# EasyEDA schematic EASYEDA_JSON.json

## Sheets
1 Mainboard_C3: TITLE: Verze Dva; REV: 1.0; Date: 2026-01-16; Sheet: 1/1; Drawn By: matyas.popela.07; Company: Cognitiv
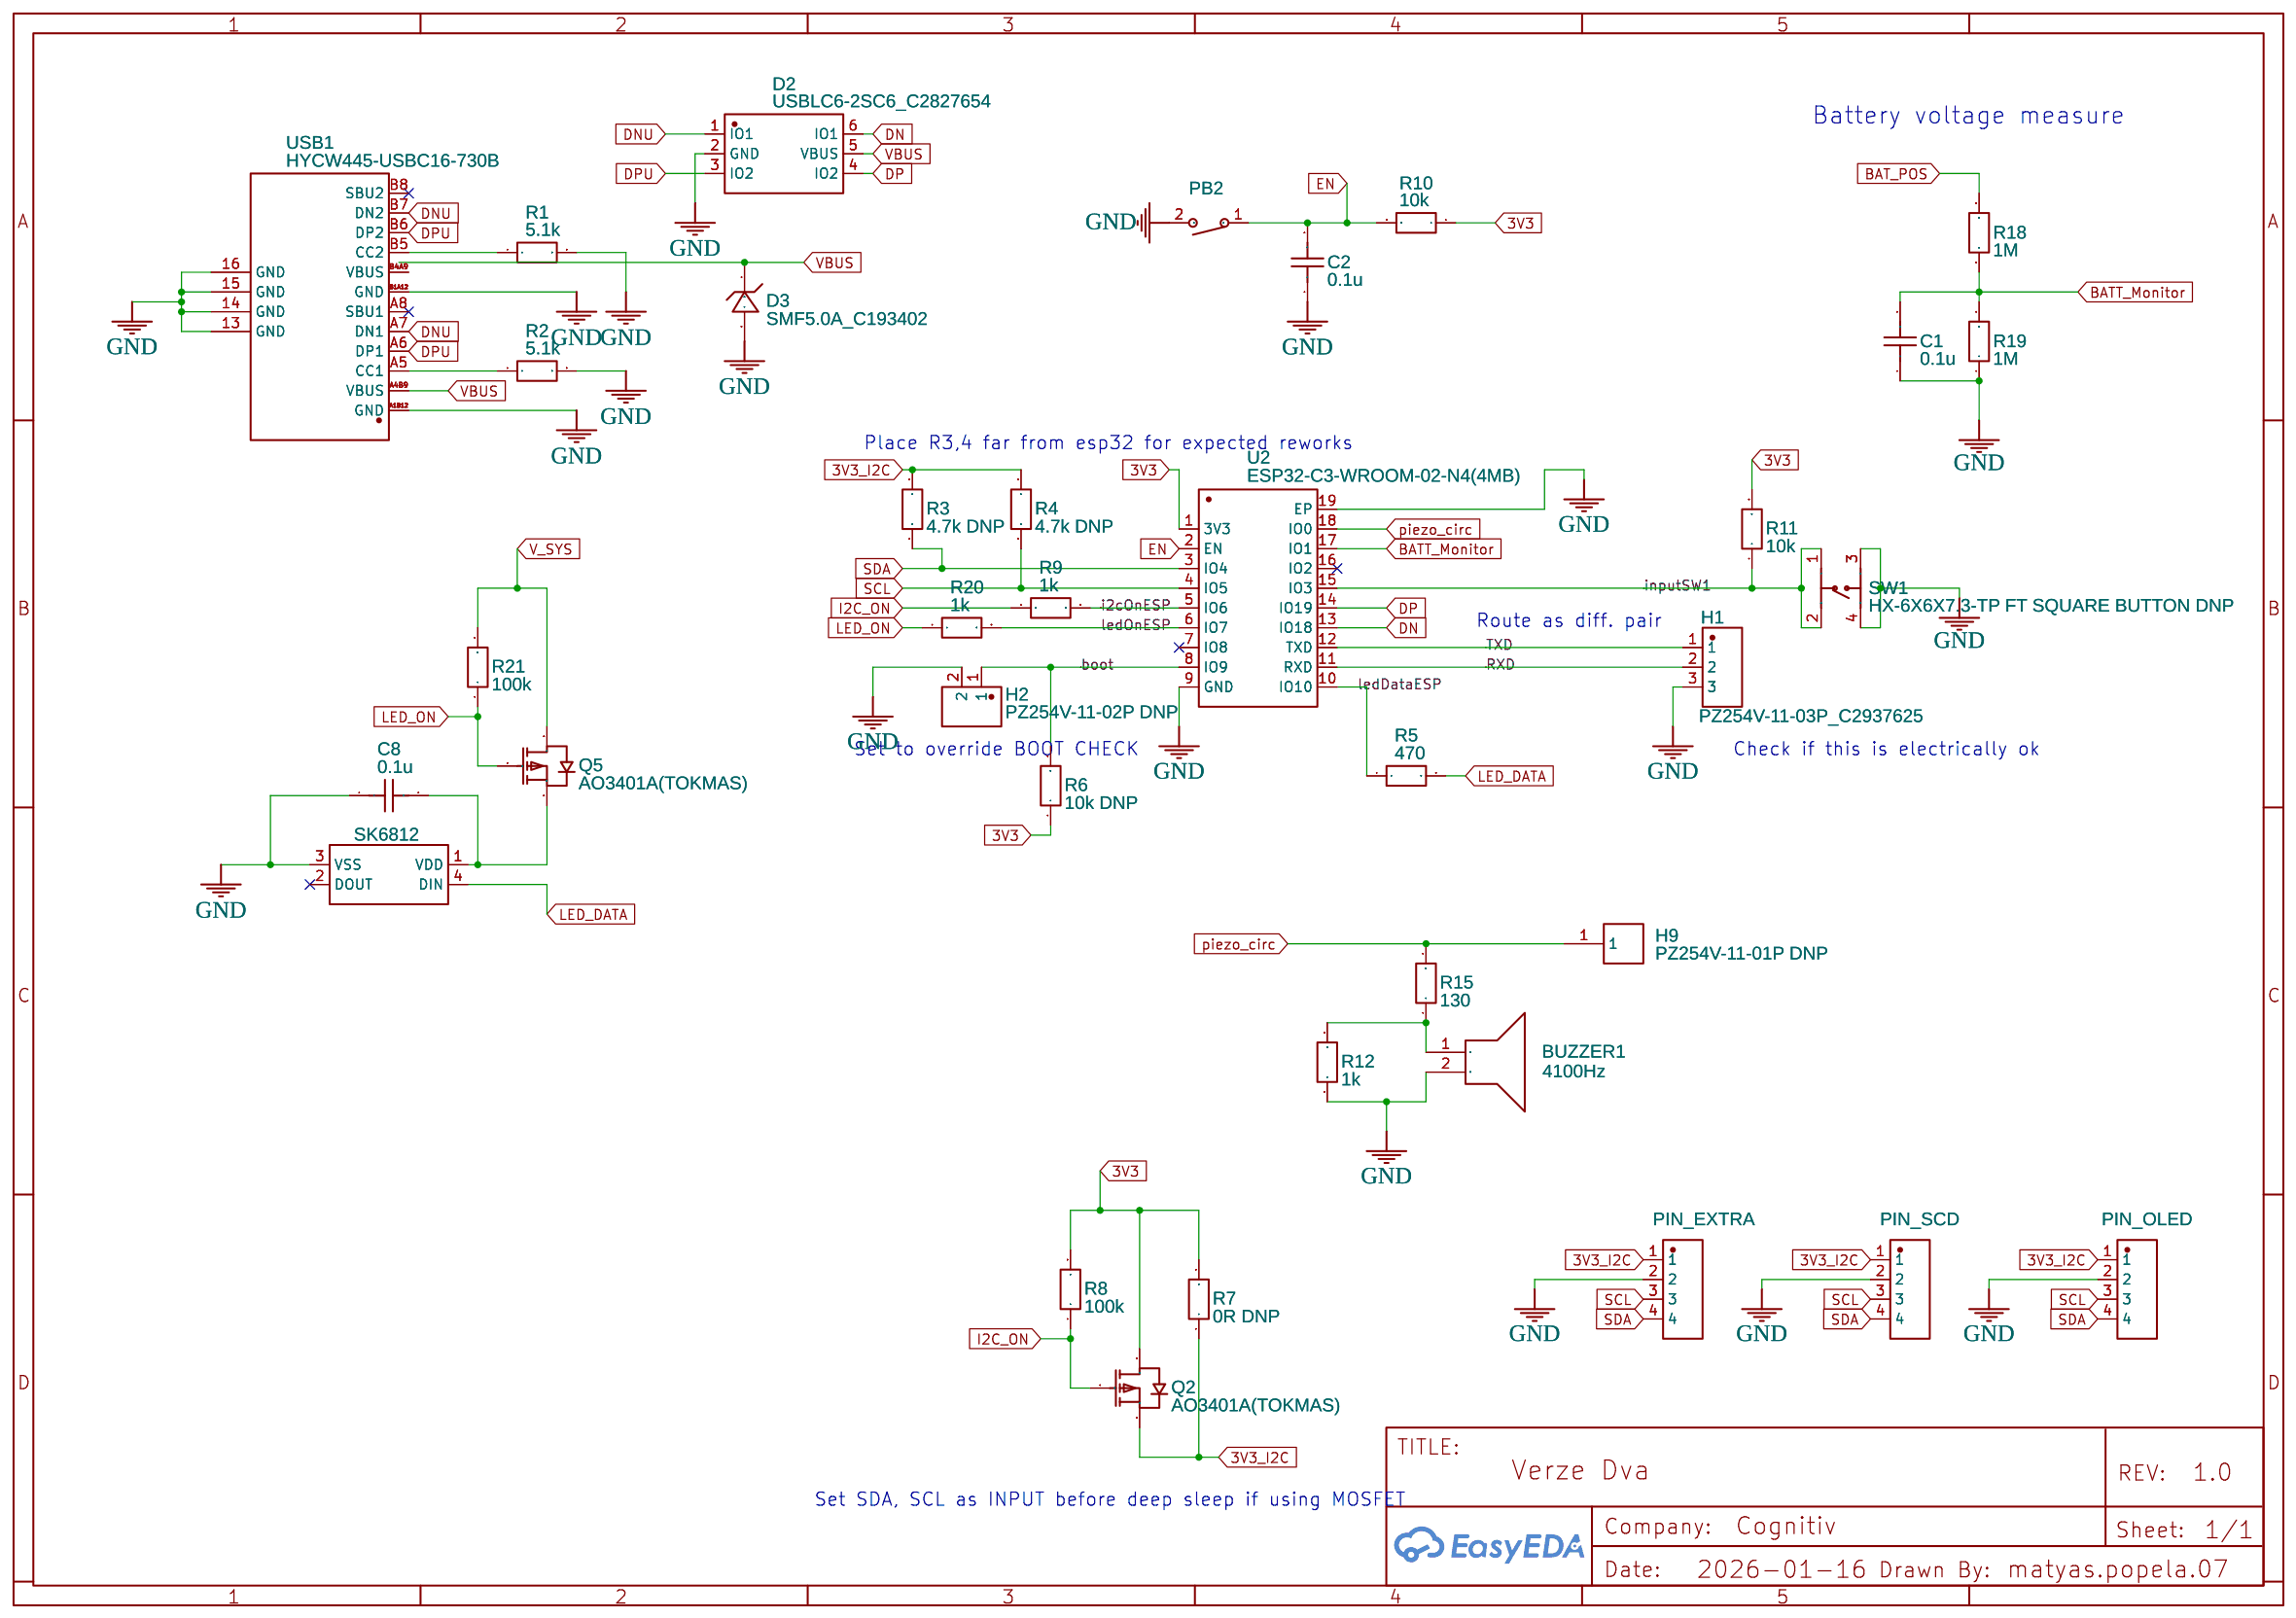
[diagram p0: Mainboard_C3]
2 Power_Management: TITLE: Power_sheet; Date: 2026-03-08; Drawn By: kzalesak; Company: Your Company
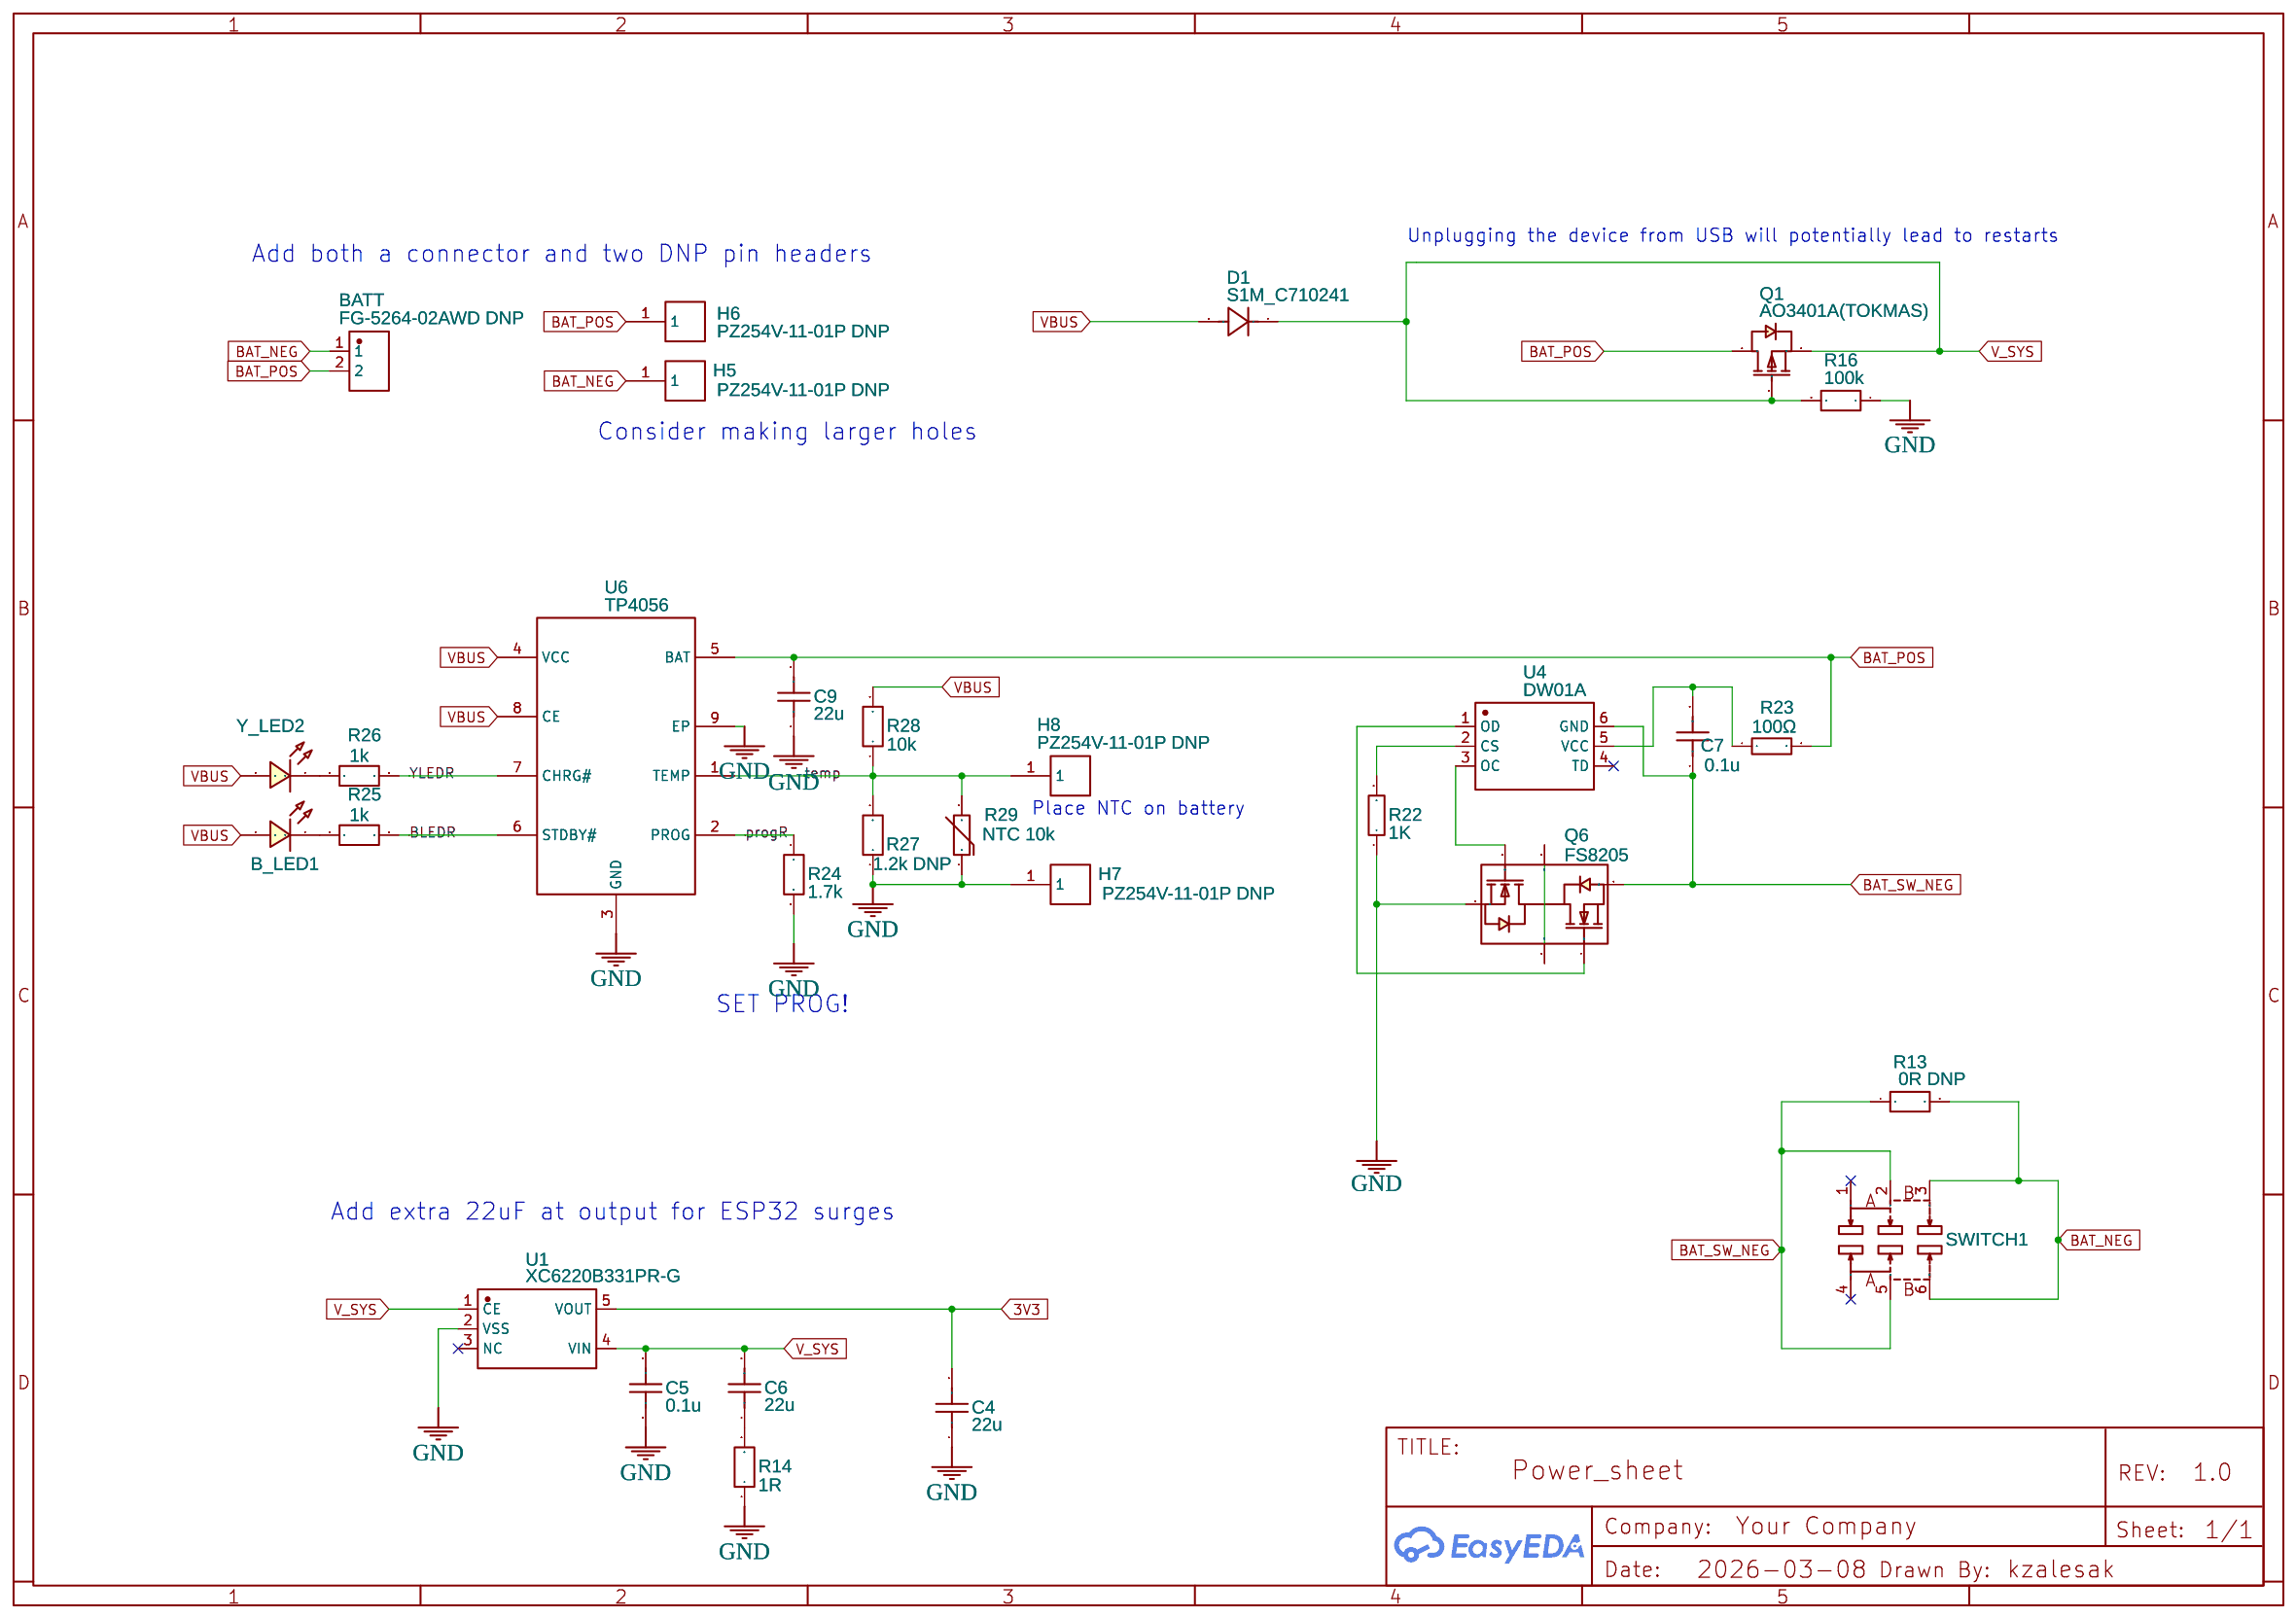
[diagram p1: Power_Management]

## Parts
sheet Mainboard_C3
BUZZER1  4100Hz  [BUZ-SMD_FST-1109]
C1  0.1u  [C0603]
C2  0.1u  [C0603]
C8  0.1u  [C0603]
D2  USBLC6-2SC6_C2827654  [SOT-23-6_L2.9-W1.6-P0.95-LS2.8-BL]
D3  SMF5.0A_C193402  [SOD-123FL_L2.7-W1.8-LS3.8-RD]
H1  PZ254V-11-03P_C2937625  [HDR-TH_3P-P2.54-V-M_PZ254V-11-03P]
H2  PZ254V-11-02P DNP  [HDR-TH_2P-P2.54-V-M]
H9  PZ254V-11-01P DNP  [HDR-TH_1P-P2.54-V-M]
PB2  HX 3X4X2-2P-1.6N TACTILE SWITCH DNP  [KEY-SMD_L4.0-W3.0-LS4.9-1]
PIN_EXTRA  2.54-1*4  [HDR-TH_4P-P2.54-V-M-1]
PIN_OLED  2.54-1*4  [HDR-TH_4P-P2.54-V-M-1]
PIN_SCD  2.54-1*4  [HDR-TH_4P-P2.54-V-M-1]
Q2  AO3401A(TOKMAS)  [SOT-23-3_L2.9-W1.3-P1.90-LS2.4-BR-1]
Q5  AO3401A(TOKMAS)  [SOT-23-3_L2.9-W1.3-P1.90-LS2.4-BR-1]
R1  5.1k  [R0603]
R2  5.1k  [R0603]
R3  4.7k DNP  [R0603]
R4  4.7k DNP  [R0603]
R5  470  [R0603]
R6  10k DNP  [R0603]
R7  0R DNP  [R0603]
R8  100k  [R0603]
R9  1k  [R0603]
R10  10k  [R0603]
R11  10k  [R0603]
R12  1k  [R0603]
R15  130  [R0603]
R18  1M  [R0603]
R19  1M  [R0603]
R20  1k  [R0603]
R21  100k  [R0603]
SK6812  SK6812_C5378720  [LED-SMD_4P-L5.0-W5.0-LS5.4-TL-1]
SW1  HX-6X6X7.3-TP FT SQUARE BUTTON DNP  [SW-SMD_4P-L6.0-W6.0-P4.50-LS9.0-H7.3]
U2  ESP32-C3-WROOM-02-N4(4MB)  [BULETM-SMD_ESPRESSIF_ESP32-C3-WROOM-02-N4-4MB]
USB1  HYCW445-USBC16-730B  [USB-TYPE-C-SMD_TYPE-C-16P-USB616FC]
sheet Power_Management
B_LED1  LED-0603_R  [LED0603_RED]
BATT  FG-5264-02AWD DNP  [CONN-TH_2P-P2.50_FG-5264-02AWD]
C4  22u  [C0805]
C5  0.1u  [C0603]
C6  22u  [C0805]
C7  0.1u  [C0603]
C9  22u  [C0805]
D1  S1M_C710241  [SMA_L4.3-W2.6-LS5.2-RD]
H5  PZ254V-11-01P DNP  [HDR-TH_1P-P2.54-V-M]
H6  PZ254V-11-01P DNP  [HDR-TH_1P-P2.54-V-M]
H7  PZ254V-11-01P DNP  [HDR-TH_1P-P2.54-V-M]
H8  PZ254V-11-01P DNP  [HDR-TH_1P-P2.54-V-M]
Q1  AO3401A(TOKMAS)  [SOT-23-3_L2.9-W1.3-P1.90-LS2.4-BR-1]
Q6  FS8205  [SOT-23-6]
R13  0R DNP  [R0805]
R14  1R  [R0603]
R16  100k  [R0603]
R22  1K  [0603]
R23  100Ω  [0603]
R24  1.7k  [R0805]
R25  1k  [R0603]
R26  1k  [R0603]
R27  1.2k DNP  [R0603]
R28  10k  [R0603]
R29  NTC 10k  [R0805]
SWITCH1  MST22D18G2 125 DNP  [SW-SMD_MST22D18G2]
U1  XC6220B331PR-G  [SOT-89-5_L4.5-W2.5-P1.50-LS4.4-BR]
U4  DW01A  [SOT-23-6L]
U6  TP4056  [ESOP-8_L4.9-W3.9-P1.27-LS6.0-BL-EP]
Y_LED2  LED-0603_R  [LED0603_RED]

## Library data of the parts
BUZZER1 = FST-1109: Contributor: LCSC; Supplier: LCSC; Supplier Part: C391036; Manufacturer: FUET(福声科技); Manufacturer Part: FUET-1109; JLCPCB Part Class: Extended Part
C1 C2 C5 C7 C8 = C_0603_US: Supplier Part: C14663; Supplier: LCSC; Contributor: LCEDA_Lib; Manufacturer Part: CC0603KRX7R9BB104; Manufacturer: YAGEO(国巨)
D2 = USBLC6-2SC6_C2827654: Contributor: LCSC; Supplier: LCSC; Supplier Part: C2827654; Manufacturer: TECH PUBLIC(台舟); Manufacturer Part: USBLC6-2SC6; JLCPCB Part Class: Extended Part
D3 = SMF5.0A_C193402: Contributor: LCSC; Supplier: LCSC; Supplier Part: C193402; Manufacturer: MDD(辰达半导体); Manufacturer Part: SMF5.0A; JLCPCB Part Class: Extended Part
H1 = PZ254V-11-03P_C2937625: Contributor: LCSC; Supplier: LCSC; Supplier Part: C2937625; Manufacturer: XFCN(兴飞); Manufacturer Part: PZ254V-11-03P; JLCPCB Part Class: Extended Part
H2 = PZ254V-11-02P: Contributor: LCSC; Supplier: LCSC; Supplier Part: C492401; Manufacturer: XFCN(兴飞); JLCPCB Part Class: Extended Part
H5-H9 = PZ254V-11-01P: Contributor: LCSC; Supplier: LCSC; Supplier Part: C492400; Manufacturer: XFCN(兴飞); JLCPCB Part Class: Extended Part
PB2 = HX 3X4X2-2P-1.6N TACTILE SWITCH: Supplier: LCSC; Supplier Part: C49234124; Manufacturer: hanxia(韩下); Manufacturer Part: HX 3x4x2-2P-1.6N TACTILE SWITCH; JLCPCB Part Class: Extended Part; Contributor: lcsc
PIN_EXTRA PIN_OLED PIN_SCD = 2.54-1*4: Supplier: LCSC; Supplier Part: C5116483; Manufacturer: ZHOURI(洲日); JLCPCB Part Class: Extended Part; Contributor: lcsc
Q1 Q2 Q5 = AO3401A(TOKMAS): Supplier: LCSC; Supplier Part: C51889389; Manufacturer: Tokmas(托克马斯); Contributor: lcsc; JLCPCB Part Class: Extended Part
R1-R16 R18-R21 R24-R28 = R_0603_EU: Contributor: LCEDA_Lib
SK6812 = SK6812_C5378720: Supplier: LCSC; Supplier Part: C5378720; Manufacturer: 欧思科光电; JLCPCB Part Class: Extended Part; Contributor: lcsc
SW1 = HX-6X6X7.3-TP FT SQUARE BUTTON: Supplier: LCSC; Supplier Part: C49234152; Manufacturer: hanxia(韩下); Manufacturer Part: HX-6x6x7.3-TP FT square button; JLCPCB Part Class: Extended Part; Contributor: lcsc
U2 = ESP32-C3-WROOM-02-N4(4MB): Contributor: LCSC; Supplier: LCSC; Supplier Part: C2934560; Manufacturer: ESPRESSIF(乐鑫); Manufacturer Part: ESP32-C3-WROOM-02-N4; JLCPCB Part Class: Extended Part
USB1 = HYCW445-USBC16-730B: Supplier: LCSC; Supplier Part: C42400246; Manufacturer: 华宇创; Contributor: lcsc; JLCPCB Part Class: Extended Part
B_LED1 Y_LED2 = LED-0603_R: Manufacturer: EVERLIGHT(台湾亿光); Manufacturer Part: 19-217/R6C-AL1M2VY/3T; Supplier Part: C72044; Supplier: LCSC; Contributor: LCEDA_01
BATT = FG-5264-02AWD: Supplier: LCSC; Supplier Part: C53325707; Manufacturer: FG(富港); JLCPCB Part Class: Extended Part; Contributor: lcsc
C4 C6 C9 = CL21A226MAQNNNE: Supplier: LCSC; Manufacturer: SAMSUNG(三星); Supplier Part: C45783; JLCPCB Part Class: Basic Part
D1 = S1M_C710241: Contributor: LCSC; Supplier: LCSC; Supplier Part: C710241; Manufacturer: DIODES(美台); Manufacturer Part: S1M; JLCPCB Part Class: Extended Part
Q6 = -: Supplier: LCSC; Manufacturer: FORTUNE; LCSC Assembly: Yes; image: //image.lceda.cn/szlcsc/C32254.jpg; Supplier Part: C32254
R22 = ERJ3GEYJ102V: Supplier: LCSC; Manufacturer: PANASONIC; Contributor: LCSC; Supplier Part: C180848
R23 = 0603WAJ0101T5E: Supplier: LCSC; Manufacturer: UniOhm; Supplier Part: C25201
R29 = CMFB103F3950FANT: Supplier: LCSC; Manufacturer: FH(风华); Supplier Part: C51597; JLCPCB Part Class: Extended Part
SWITCH1 = MST22D18G2 125: Contributor: LCSC; Supplier: LCSC; Supplier Part: C2906280; Manufacturer: SHOU HAN(首韩); JLCPCB Part Class: Extended Part; link: https://lcsc.com/eda_search?q=C2906280&%26type=1&ref=editor
U1 = XC6220B331PR-G: Contributor: lcsc; Supplier: LCSC; Supplier Part: C3013658; Manufacturer: TOREX(特瑞仕); JLCPCB Part Class: Extended Part
U4 = -: Supplier: LCSC; Manufacturer: PUOLOP; Contributor: LCSC; Supplier Part: C351410
U6 = TP4056: Contributor: Guest; Supplier: LCSC; Manufacturer: TOPPOWER(南京拓微); Manufacturer Part: TP4056-42-ESOP8; Supplier Part: C16581; JLCPCB Part Class: Extended Part

## Nets
3V3: C4.2 Q2.3(D) R6.1 R7.2 R8.2 R10.1 R11.2 U1.5(VOUT) U2.1(3V3)
3V3_I2C: PIN_EXTRA.1 PIN_OLED.1 PIN_SCD.1 Q2.2(S) R3.2 R4.2 R7.1
GND: BUZZER1.2 C1.1 C2.1 C4.1 C5.1 C8.1 C9.1 D2.2(GND) D3.2(A) H1.3 H2.2 H7.1 PB2.2 PIN_EXTRA.2 PIN_OLED.2 PIN_SCD.2 Q6.1(S1) R1.2 R2.2 R12.1 R14.1 R16.1 R19.1 R22.1 R24.2 R27.1 R29.1 SK6812.3(VSS) SW1.3(C) SW1.4(D) U1.2(VSS) U2.9(GND) U2.19(EP) U6.3(GND) U6.9(EP) USB1.13(GND) USB1.14(GND) USB1.15(GND) USB1.16(GND) USB1.A1B12(GND) USB1.B1A12(GND)
VBUS: B_LED1.1 D1.2(A) D2.5(VBUS) D3.1(C) R28.2 U6.4(VCC) U6.8(CE) USB1.A4B9(VBUS) Y_LED2.1
BAT_NEG: BATT.1 H5.1 R13.2 SWITCH1.3 SWITCH1.6
BAT_POS: BATT.2 C9.2 H6.1 Q1.3(D) R18.2 R23.2 U6.5(BAT)
BAT_SW_NEG: C7.1 Q6.3(S2) R13.1 SWITCH1.2 SWITCH1.5 U4.6(GND)
BATT_Monitor: C1.2 R18.1 R19.2 U2.17(IO1)
BLEDR: R25.2 U6.6(STDBY#)
boot: H2.1 R6.2 U2.8(IO9)
DN: D2.6(IO1) U2.13(IO18)
DNU: D2.1(IO1) USB1.A7(DN1) USB1.B7(DN2)
DP: D2.4(IO2) U2.14(IO19)
DPU: D2.3(IO2) USB1.A6(DP1) USB1.B6(DP2)
EN: C2.2 PB2.1 R10.2 U2.2(EN)
I2C_ON: Q2.1(G) R8.1 R9.1
i2cOnESP: R9.2 U2.5(IO6)
inputSW1: R11.1 SW1.1(A) SW1.2(B) U2.15(IO3)
LED_DATA: R5.2 SK6812.4(DIN)
LED_ON: Q5.1(G) R20.1 R21.1
ledDataESP: R5.1 U2.10(IO10)
ledOnESP: R20.2 U2.6(IO7)
piezo_circ: H9.1 R15.2 U2.18(IO0)
progR: R24.1 U6.2(PROG)
RXD: H1.2 U2.11(RXD)
SCL: PIN_EXTRA.3 PIN_OLED.3 PIN_SCD.3 R4.1 U2.4(IO5)
SDA: PIN_EXTRA.4 PIN_OLED.4 PIN_SCD.4 R3.1 U2.3(IO4)
temp: H8.1 R27.2 R28.1 R29.2 U6.1(TEMP)
TXD: H1.1 U2.12(TXD)
V_SYS: C5.2 C6.2 D1.1(K) Q1.1(G) Q1.2(S) Q5.3(D) R16.2 R21.2 U1.1(CE) U1.4(VIN)
YLEDR: R26.2 U6.7(CHRG#)
Net-(B_LED1-2): B_LED1.2 R25.1
Net-(BUZZER1-1): BUZZER1.1 R12.2 R15.1
Net-(C6-1): C6.1 R14.2
Net-(C7-2): C7.2 R23.1 U4.5(VCC)
Net-(C8-2): C8.2 Q5.2(S) SK6812.1(VDD)
Net-(Q6-2): Q6.2(D12) Q6.5(D12)
Net-(Q6-4): Q6.4(G2) U4.1(OD)
Net-(Q6-6): Q6.6(G1) U4.3(OC)
Net-(R1-1): R1.1 USB1.B5(CC2)
Net-(R2-1): R2.1 USB1.A5(CC1)
Net-(R22-2): R22.2 U4.2(CS)
Net-(R26-1): R26.1 Y_LED2.2

Not connected (* = marked no-connect by the designer): SK6812 2(DOUT)*; SWITCH1 1* 4*; U1 3(NC)*; U2 7(IO8)* 16(IO2)*; U4 4(TD)*; USB1 A8(SBU1)* B4A9(VBUS) B8(SBU2)*

## Notes on the sheets
sheet 1
- Battery voltage measure
- Place R3,4 far from esp32 for expected reworks
- Route as diff. pair
- Set to override BOOT CHECK
- Check if this is electrically ok
- Set SDA, SCL as INPUT before deep sleep if using MOSFET
sheet 2
- Unplugging the device from USB will potentially lead to restarts
- Add both a connector and two DNP pin headers
- Consider making larger holes
- Place NTC on battery
- SET PROG!
- Add extra 22uF at output for ESP32 surges
